# EAGLE design AltiSphere 2 (EAGLE 5.11)
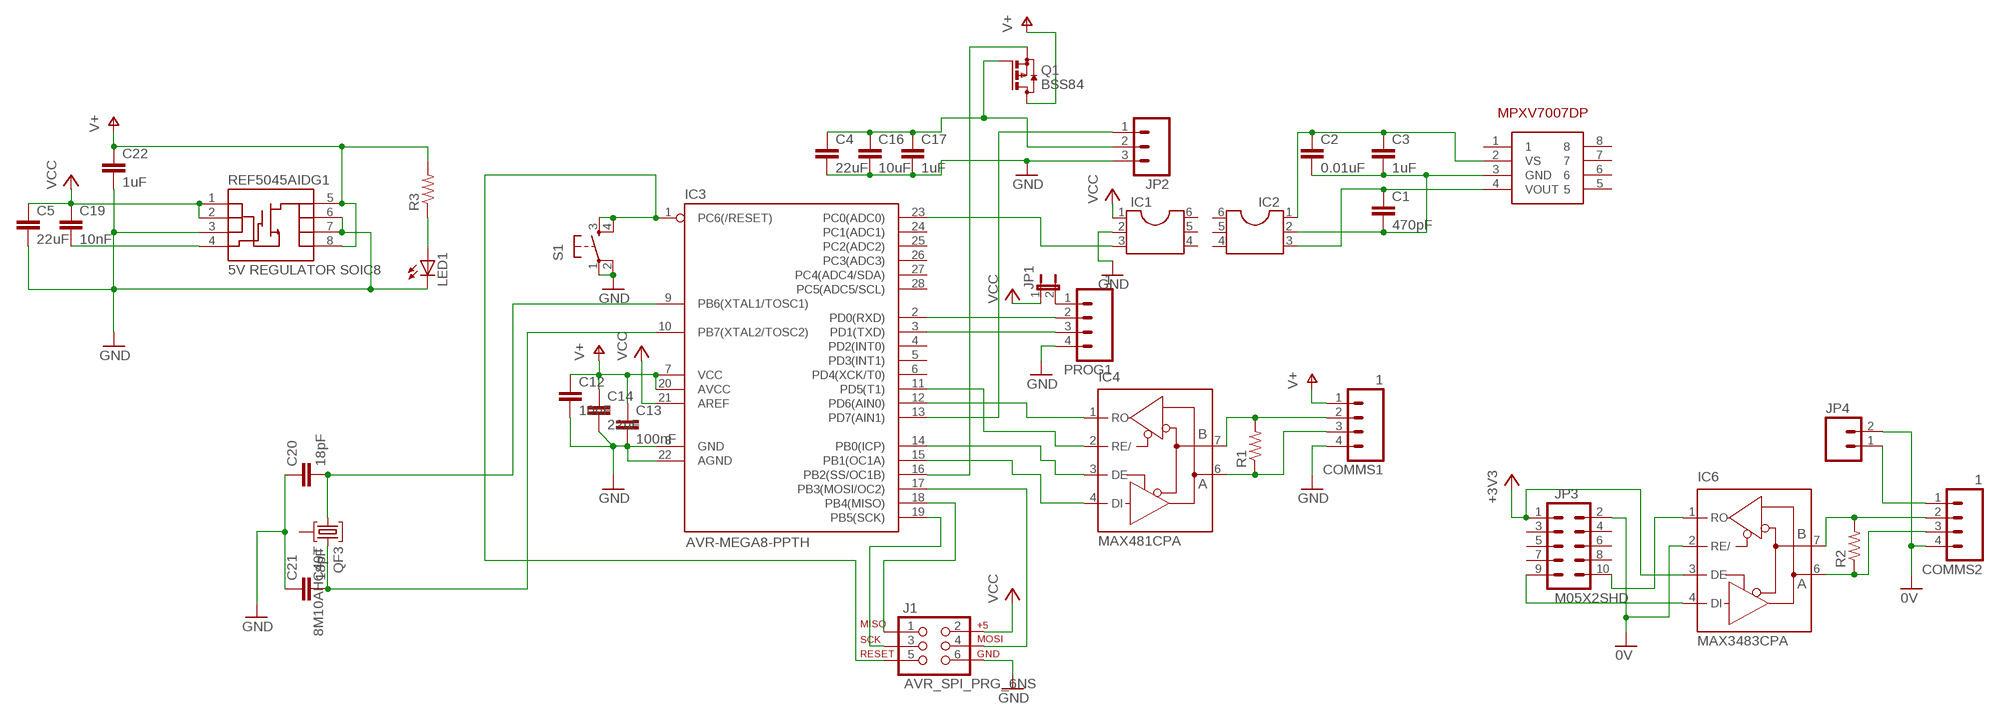
[diagram p0: schematic, sheet 1]

## Parts
C1  470pF  CAP0805  [0805]
C2  0.01uF  CAP0805  [0805]
C3  1uF  CAP0805  [0805]
C4  22uF  CAP1210  [1210]
C5  22uF  CAP1210  [1210]
C12  10nF  CAP0805  [0805]
C13  100nF  CAP0805  [0805]
C14  22uF  CAP0805  [0805]
C16  10uF  CAP0805  [0805]
C17  1uF  CAP0805  [0805]
C19  10nF  CAP0805  [0805]
C20  18pF  CAP0805  [0805]
C21  18pF  CAP0805  [0805]
C22  1uF  CAP0805  [0805]
COMMS1  1  M04POLAR  [MOLEX-1X4]
COMMS2  1  M04POLAR  [MOLEX-1X4]
IC1  DIL6  [DIL06]
IC2  DIL6  [DIL06]
IC3  AVR-MEGA8-PPTH  [DIL28-3]
IC4  MAX481CPA  [DIL08]
IC6  MAX3483CPA  [DIL08]
J1  AVR_SPI_PRG_6NS  [2X3-NS]
JP1  JUMPER-2PTH  [1X02]
JP2  M03POLAR  [MOLEX-1X3]
JP3  M05X2SHD  [2X5-SHROUDED]
JP4  M02LOCK_LONGPADS  [1X02_LOCK_LONGPADS]
LED1  LEDCHIP-LED0805  [CHIP-LED0805]
PROG1  1  M04POLAR  [MOLEX-1X4]
Q1  BSS84  [SOT23]
QF3  8M10AHC49T  [HC49U]
R1  RESISTOR0805-RES  [0805]
R2  RESISTOR0805-RES  [0805]
R3  RESISTOR0805-RES  [0805]
REF5045AIDG1  5V REGULATOR SOIC8  MOSFET-NCHANNEL-SOIC8  [SO08]
S1  TAC_SWITCHPTH  [TACTILE-PTH]
U$1  MPXV7007DPSOIC  [MPXV7007DP]

## Nets
0V: COMMS2.4 IC6.2(RE/) JP3.2 JP4.2
+3V3: IC6.3(DE) JP3.1
GND: C4.2 C5.2 C12.2 C13.2 C14.2 C16.2 C17.2 C20.1 C21.1 C22.2 COMMS1.4 IC1.2 IC3.8(GND) IC3.22(AGND) J1.6 JP2.3 LED1.C PROG1.4 REF5045AIDG1.3(S) REF5045AIDG1.6(D) REF5045AIDG1.7(D) S1.1 S1.2
N$1: C4.1 C16.1 C17.1 JP2.2 Q1.1(G)
N$2: IC3.19(PB5(SCK)) J1.3
N$3: IC3.1(PC6(/RESET)) J1.5 S1.3 S1.4
N$4: IC1.3 IC3.23(PC0(ADC0))
N$5: IC3.18(PB4(MISO)) J1.1
N$6: IC3.17(PB3(MOSI/OC2)) J1.4
N$7: IC3.13(PD7(AIN1)) JP2.1
N$8: COMMS1.2 IC4.7(B) R1.2
N$9: COMMS1.3 IC4.6(A) R1.1
N$10: IC3.2(PD0(RXD)) PROG1.2
N$11: IC3.3(PD1(TXD)) PROG1.3
N$12: IC3.12(PD6(AIN0)) IC4.1(RO)
N$13: IC3.11(PD5(T1)) IC4.2(RE/)
N$14: IC3.14(PB0(ICP)) IC4.3(DE)
N$15: IC3.15(PB1(OC1A)) IC4.4(DI)
N$16: JP1.2 PROG1.1
N$17: C20.2 IC3.9(PB6(XTAL1/TOSC1)) QF3.1
N$18: C21.2 IC3.10(PB7(XTAL2/TOSC2)) QF3.3
N$19: IC3.16(PB2(SS/OC1B)) Q1.2(S)
N$20: COMMS2.2 IC6.7(B) R2.2
N$21: COMMS2.3 IC6.6(A) R2.1
N$22: LED1.A R3.1
N$23: C19.2 REF5045AIDG1.4(G)
N$24: IC6.1(RO) JP3.10
N$25: IC6.4(DI) JP3.9
N$27: COMMS2.1 JP4.1
N$31: C1.1 IC2.3 U$1.4(VOUT)
N$32: C2.1 C3.1 IC2.1 U$1.2(VS)
N$34: C1.2 C2.2 C3.2 IC2.2 U$1.3(GND)
V+: C12.1 C13.1 C14.1 C22.1 COMMS1.1 IC3.7(VCC) IC3.20(AVCC) Q1.3(D) R3.2 REF5045AIDG1.5(D) REF5045AIDG1.8(D)
VCC: C5.1 C19.1 IC1.1 IC3.21(AREF) J1.2 JP1.1 REF5045AIDG1.1(S) REF5045AIDG1.2(S)
Unconnected: IC1.4 IC1.5 IC1.6 IC2.4 IC2.5 IC2.6 IC3.4(PD2(INT0)) IC3.5(PD3(INT1)) IC3.6(PD4(XCK/T0)) IC3.24(PC1(ADC1)) IC3.25(PC2(ADC2)) IC3.26(PC3(ADC3)) IC3.27(PC4(ADC4/SDA)) IC3.28(PC5(ADC5/SCL)) JP3.3 JP3.4 JP3.5 JP3.6 JP3.7 JP3.8 QF3.2 U$1.1 U$1.5 U$1.6 U$1.7 U$1.8

## Power pins joined to a net without a drawn wire
0V: IC6.5(0V)
+3V3: IC6.8(+3V3)
GND: IC4.5(GND)
VCC: IC4.8(VCC)

## Library data of the parts
C1-C5 C12-C14 C16 C17 C19-C22 = SparkFun:CAP: Capacitor Standard 0603 ceramic capacitor, and 0.1" leaded capacitor.
COMMS1 COMMS2 PROG1 = SparkFun:M04: Header 4 Standard 4-pin 0.1" header. Use with straight break away headers (SKU : PRT-00116), right angle break away headers (PRT-00553), swiss pins (PRT-00743), machine pins (PRT-00117), and female headers (PRT-00115). Molex polarized connector foot print use with SKU : PRT-08231 with associated crimp pins and housings. 1MM SMD Version SKU: PRT-10208
IC1 IC2 = ic-package:DIL6: Dual In Line / Socket
IC3 = SparkFun:AVR-MEGA8-P: MICROCONTROLLER 8 Kbytes FLASH 1 kbytes SRAM 512 bytes EEPROM USART 4-channel 10 bit ADC 2-channel 8 bit ADC
IC4 = maxim:MAX481CPA: RS485 TRANSEIVER; MPN: MAX481CPA+; OC_FARNELL: unknown; OC_NEWARK: 99K3445
IC6 = maxim-10:MAX3483CPA: RS485 TRANSEIVER
J1 = SparkFun:AVR_SPI_PRG_6: AVR ISP 6 Pin This is the reduced ISP connector for AVR programming. Common on Arduino. This footprint will take up less PCB space and can be used with a 10-pin to 6-pin adapter such as SKU: BOB-08508
JP1 = SparkFun:JUMPER-2: Jumper Basic 0.1" spaced jumper. Use with breakaway headers.
JP2 = SparkFun:M03: Header 3 Standard 3-pin 0.1" header. Use with straight break away headers (SKU : PRT-00116), right angle break away headers (PRT-00553), swiss pins (PRT-00743), machine pins (PRT-00117), and female headers (PRT-00115). Molex polarized connector foot print use with SKU : PRT-08232 with associated crimp pins and housings.
JP3 = SparkFun:M05X2: Header 5x2 Standard 10-pin dual row 0.1" header. Commonly used with AVR-ISP. Use with Spark Fun Electronics SKU: PRT-00778
JP4 = SparkFun:M02: Header 2 Standard 2-pin 0.1" header. Use with straight break away headers (SKU : PRT-00116), right angle break away headers (PRT-00553), swiss pins (PRT-00743), machine pins (PRT-00117), and female headers (PRT-00115). Molex polarized connector foot print use with SKU : PRT-08233 with associated crimp pins and housings.
LED1 = led:LED: LED OSRAM: - CHIPLED LG R971, LG N971, LY N971, LG Q971, LY Q971, LO R971, LY R971 LH N974, LH R974 LS Q976, LO Q976, LY Q976 LO Q996 - Hyper CHIPLED LW Q18S LB Q993, LB Q99A, LB R99A - SideLED LS A670, LO A670, LY A670, LG A670, LP A670 LB A673, LV A673, LT A673, LW A673 LH A674 LY A675 LS A676, LA A676, LO A676, LY A676, LW A676 LS A679, LY A679, LG A679 - Hyper Micro SIDELED® LS Y876, LA Y876, LO Y876, LY Y876 LT Y87S - SmartLED LW L88C, LW L88S LB L89C, LB L89S, LG L890 LS L89K, LO L89K, LY L89K LS L896, LA L896, LO L896, LY L896 - TOPLED LS T670, LO T670, LY T670, LG T670, LP T670 LSG T670, LSP T670, LSY T670, LOP T670, LYG T670 LG T671, LOG T671, LSG T671 LB T673, LV T673, LT T673, LW T673 LH T674 LS T676, LA T676, LO T676, LY T676, LB T676, LH T676, LSB T676, LW T676 LB T67C, LV T67C, LT T67C, LS T67K, LO T67K, LY T67K, LW E67C LS E67B, LA E67B, LO E67B, LY E67B, LB E67C, LV E67C, LT E67C LW T67C LS T679, LY T679, LG T679 LS T770, LO T770, LY T770, LG T770, LP T770 LB T773, LV T773, LT T773, LW T773 LH T774 LS E675, LA E675, LY E675, LS T675 LS T776, LA T776, LO T776, LY T776, LB T776 LHGB T686 LT T68C, LB T68C - Hyper Mini TOPLED® LB M676 - Mini TOPLED Santana® LG M470 LS M47K, LO M47K, LY M47K Source: http://www.osram.convergy.de LUXEON: - LUMILED® LXK2-PW12-R00, LXK2-PW12-S00, LXK2-PW14-U00, LXK2-PW14-V00 LXK2-PM12-R00, LXK2-PM12-S00, LXK2-PM14-U00 LXK2-PE12-Q00, LXK2-PE12-R00, LXK2-PE12-S00, LXK2-PE14-T00, LXK2-PE14-U00 LXK2-PB12-K00, LXK2-PB12-L00, LXK2-PB12-M00, LXK2-PB14-N00, LXK2-PB14-P00, LXK2-PB14-Q00 LXK2-PR12-L00, LXK2-PR12-M00, LXK2-PR14-Q00, LXK2-PR14-R00 LXK2-PD12-Q00, LXK2-PD12-R00, LXK2-PD12-S00 LXK2-PH12-R00, LXK2-PH12-S00 LXK2-PL12-P00, LXK2-PL12-Q00, LXK2-PL12-R00 Source: www.luxeon.com KINGBRIGHT: KA-3528ASYC Source: www.kingbright.com
Q1 = transistor-small-signal:BSS84: P-CHANNEL MOS FET
QF3 = crystal:8M10AHC49T: Monolithic Crystal Filters Source: www.vanlong.com; OC_FARNELL: unknown; OC_NEWARK: unknown
R1-R3 = SparkFun:RESISTOR: Resistor Basic schematic elements and footprints for 0603, 1206, and PTH resistors.
REF5045AIDG1 = SparkFun:MOSFET-NCHANNEL-SOIC8: N-Channel MOSFET IRF9410 and NDS8434 are common, SOIC-8 parts.
S1 = SparkFun:TAC_SWITCH: Momentary Switch Button commonly used for reset or general input. Spark Fun Electronics SKU : COM-00097
U$1 = Mine:MPXV7007DP

## Board
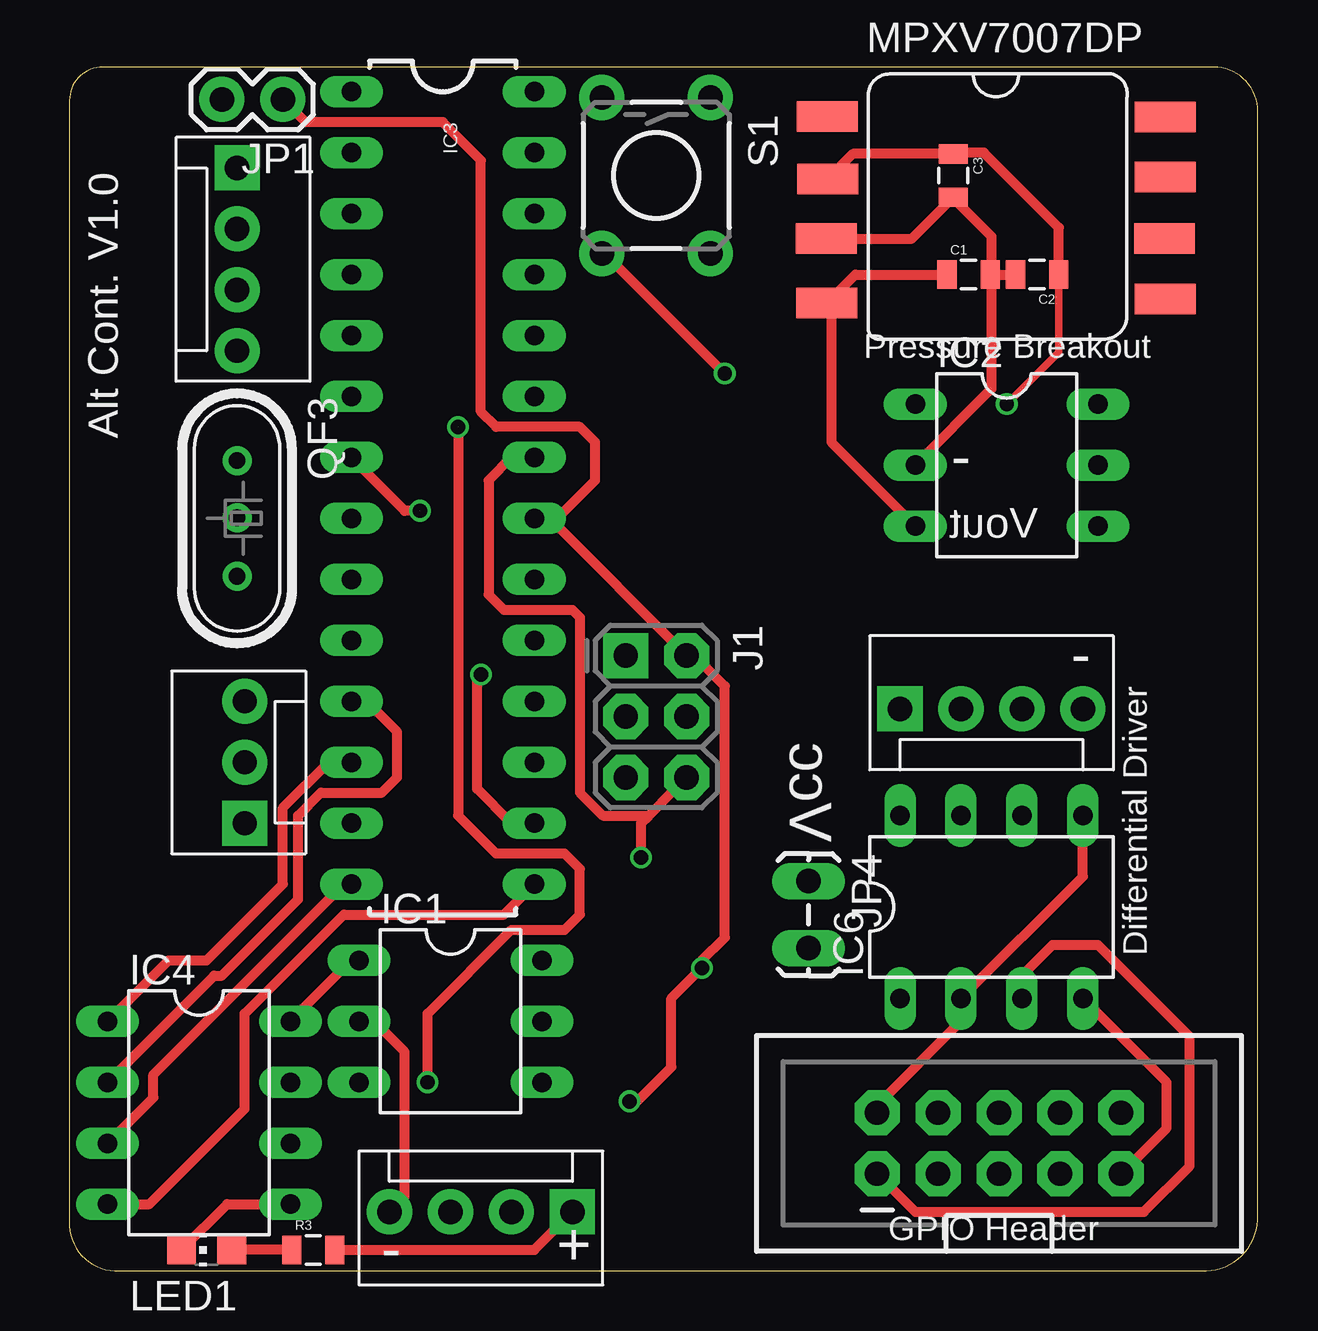
[diagram p1: board, top side]
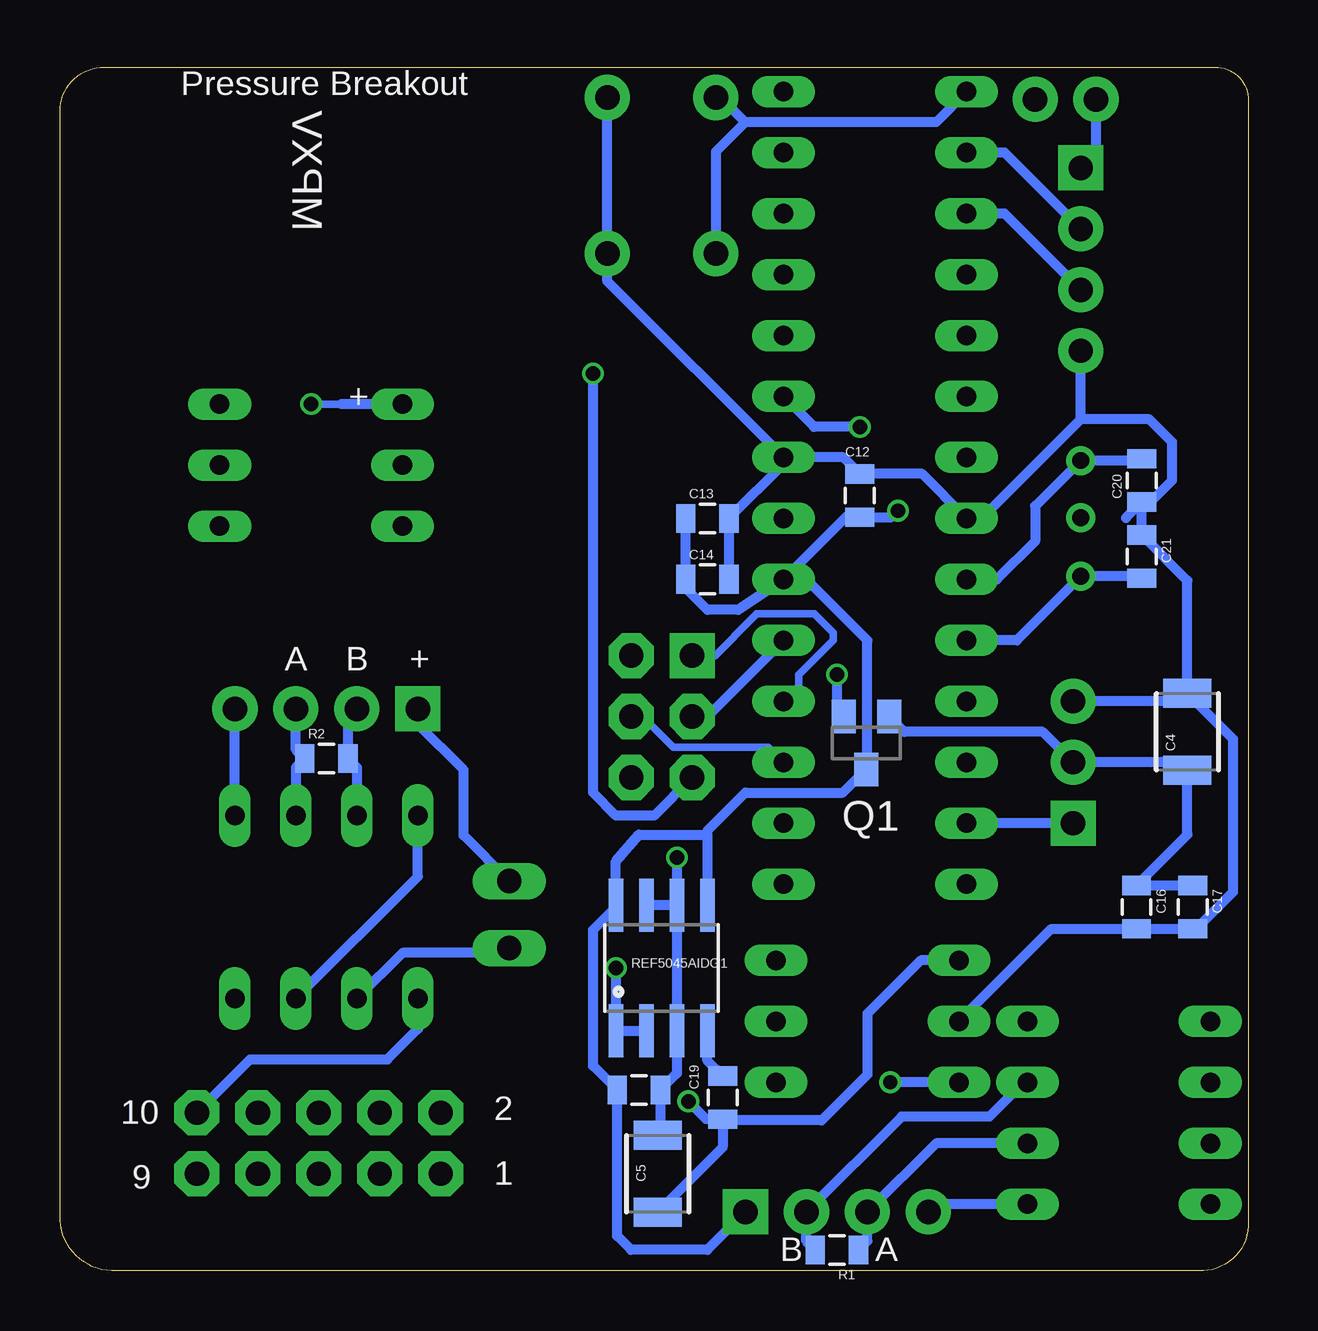
[diagram p2: board, bottom side, seen from below]

Size 49.52 x 50.16 mm. Coordinates in mm from the lower left corner, seen from the top.
Outline: 1.38,50.16 arc90 0,48.78 0,2.05 arc90 1.89,0 47.36,0 arc90 49.52,2.31 49.52,48.32 arc90 47.68,50.16 1.38,50.16
Copper layers (1*16): Top 0.035mm / dielectric 1.5mm / Bottom 0.035mm
Design rules "Fusion_eagle_rule_v1.1": minimum track width 6mil, minimum drill 12mil, track to track 6mil, track to pad 6mil, pad to pad 6mil, via to via 6mil, smd to smd 0mil, copper to edge 10mil, drill to drill 10mil, minimum pad ring 10mil, minimum via ring 6mil, stop-mask expansion 2mil, vias tented up to drill 100mil, thermal gap 10mil

### Footprints (pad centres in the part's own frame; a part is rotated, then mirrored left to right if it is on the bottom)
0805 = smd 0.8 x 1.2: 1 -0.9,0; 2 0.9,0
1210 = smd 1.2 x 2: 1 -1.6,0; 2 1.6,0
MOLEX-1X4 = drill 1.016 pad 1.88 square: 1 0,0 | drill 1.016 pad 1.88 round: 2 2.54,0; 3 5.08,0; 4 7.62,0
DIL06 = drill 0.813 long: 1 -2.54,-3.81; 2 0,-3.81; 3 2.54,-3.81; 4 2.54,3.81; 5 0,3.81; 6 -2.54,3.81
DIL28-3 = drill 0.813 long: 1 -16.51,-3.81; 2 -13.97,-3.81; 3 -11.43,-3.81; 4 -8.89,-3.81; 5 -6.35,-3.81; 6 -3.81,-3.81; 7 -1.27,-3.81; 8 1.27,-3.81; 9 3.81,-3.81; 10 6.35,-3.81; 11 8.89,-3.81; 12 11.43,-3.81; 13 13.97,-3.81; 14 16.51,-3.81; 15 16.51,3.81; 16 13.97,3.81; 17 11.43,3.81; 18 8.89,3.81; 19 6.35,3.81; 20 3.81,3.81; 21 1.27,3.81; 22 -1.27,3.81; 23 -3.81,3.81; 24 -6.35,3.81; 25 -8.89,3.81; 26 -11.43,3.81; 27 -13.97,3.81; 28 -16.51,3.81
DIL08 = drill 0.813 long: 1 -3.81,-3.81; 2 -1.27,-3.81; 3 1.27,-3.81; 4 3.81,-3.81; 5 3.81,3.81; 6 1.27,3.81; 7 -1.27,3.81; 8 -3.81,3.81
2X3-NS = drill 1.016 pad 1.88 square: 1 -2.54,-1.27 | drill 1.016 pad 1.88 octagon: 2 -2.54,1.27; 3 0,-1.27; 4 0,1.27; 5 2.54,-1.27; 6 2.54,1.27
1X02 = drill 1.016 pad 1.88 round: 1 0,0; 2 2.54,0
MOLEX-1X3 = drill 1.016 pad 1.88 square: 1 0,0 | drill 1.016 pad 1.88 round: 2 2.54,0; 3 5.08,0
2X5-SHROUDED = drill 1.016 pad 1.88 octagon: 1 -1.27,5.08; 2 1.27,5.08; 3 -1.27,2.54; 4 1.27,2.54; 5 -1.27,0; 6 1.27,0; 7 -1.27,-2.54; 8 1.27,-2.54; 9 -1.27,-5.08; 10 1.27,-5.08
1X02_LOCK_LONGPADS = drill 1.016 long: 1 -0.127,0; 2 2.667,0
CHIP-LED0805 = smd 1.2 x 1.2: A 0,-1.05; C 0,1.05
SOT23 = smd 1 x 1.4: 1 -0.95,-1.1; 2 0.95,-1.1; 3 0,1.1
HC49U = drill 0.7 pad 1.2 round: 1 -2.413,0; 2 -0.027,0; 3 2.413,0
SO08 = smd 0.61 x 2.21: 1 -1.905,-2.616; 2 -0.635,-2.616; 3 0.635,-2.616; 4 1.905,-2.616; 5 1.905,2.616; 6 0.635,2.616; 7 -0.635,2.616; 8 -1.905,2.616
TACTILE-PTH = drill 1.016 pad 1.88 round: 1 -3.251,2.261; 2 3.251,2.261; 3 -3.251,-2.261; 4 3.251,-2.261
MPXV7007DP = smd 1.27 x 2.54: 1 -3.81,-7.087; 2 -1.206,-7.074; 3 1.27,-7.137; 4 3.962,-7.112; 5 3.785,6.985; 6 1.27,6.96; 7 -1.295,6.985; 8 -3.785,6.985

### Placement (x,y rotation side)
C1  37.47,41.51 0 top
C2  40.32,41.51 180 top
C3  36.83,45.64 270 top
C4  2.54,22.46 90 bottom
C5  24.61,4.05 90 bottom
C12  16.19,32.3 90 bottom
C13  22.54,31.35 0 bottom
C14  22.54,28.81 0 bottom
C16  4.66,15.15 270 bottom
C17  2.32,15.16 270 bottom
C19  21.91,7.22 90 bottom
C20  4.45,32.94 90 bottom
C21  4.45,29.76 270 bottom
C22  25.4,7.54 0 bottom
COMMS1  20.95,2.46 180 top
COMMS2  34.61,23.41 0 top
IC1  15.87,10.4 270 top
IC2  39.05,33.57 270 top
IC3  15.56,32.62 270 top
IC4  5.4,6.59 270 top
IC6  38.42,15.16 0 top
J1  24.45,23.1 270 top
JP1  8.89,48.81 180 top
JP2  7.3,18.65 90 top
JP3  38.73,5.32 90 top
JP4  30.8,16.11 270 top
LED1  5.71,0.87 90 top
PROG1  6.98,45.96 270 top
Q1  15.92,22 180 bottom
QF3  6.98,31.35 270 top
R1  17.15,0.87 180 bottom
R2  38.42,21.35 0 bottom
R3  10.16,0.87 0 top
REF5045AIDG1  24.45,12.62 0 bottom
S1  24.45,45.64 270 top
U$1  38.67,44.28 270 top

### Tracks (layer width: path | path; a pad name or v marks a point on that pad's centre or on a via)
0V
  Top 0.406: IC6.5 42.23,16.43 IC6.2 37.15,10.4 33.66,6.9 JP3.2
  Bottom 0.406: IC6.5 COMMS2.4 | JP4.2 30.99,13.25 35.24,13.25 IC6.2
+3V3
  Top 0.406: JP3.1 35.24,2.46 44.77,2.46 46.67,4.36 46.67,9.76 42.86,13.57 40.96,13.57 39.69,12.3 IC6.3
  Bottom 0.406: IC6.8 34.61,16.43 IC6.3
GND  (via drill 0.6)
  Top 0.406: COMMS1.4 13.97,3.09 13.97,9.13 12.7,10.4 IC1.2 | LED1.C 6.57,2.78 IC4.5 | 24.13,18.97 25.16,20 J1.6 | 24.13,18.97 22.23,18.97 21.27,19.92 21.27,27.22 20.95,27.54 18.1,27.54 17.46,28.18 17.46,32.94 18.41,33.89 IC3.22 | v23.81,17.22 23.81,18.65 24.13,18.97
  Bottom 0.406: C5.2 24.5,5.75 C22.2 23.81,8.23 REF5045AIDG1.3 REF5045AIDG1.6 | REF5045AIDG1.6 REF5045AIDG1.7 | COMMS1.4 13.02,2.78 IC4.5 | IC1.2 8.21,14.25 C16.2 C17.2 2.17,14.26 0.63,15.79 0.63,22.16 C4.2 | C4.2 2.87,23.73 JP2.3 | C20.1 C21.1 2.54,28.76 C4.2 | C20.1 5.11,31.38 | 6.98,35.48 11.11,31.35 IC3.8 13.6,33.2 C12.2 16.88,33.89 IC3.22 | 6.98,35.48 PROG1.4 | C20.1 4.39,31.99 4.13,31.99 3.18,32.94 3.18,34.53 4.13,35.48 6.98,35.48 | S1.1 S1.2 26.71,41.23 IC3.22 | C14.2 C13.2 19.37,33.63 IC3.22 | v23.81,17.22 REF5045AIDG1.6
N$1
  Bottom 0.406: Q1.1 14.33,22.46 8.57,22.46 JP2.2 2.87,21.19 C4.1 2.54,18.18 C16.1 C17.1
N$2
  Bottom 0.406: J1.3 22.54,23.1 IC3.19
N$3  (via drill 0.6)
  Top 0.406: v27.3,37.38 22.3,42.39 S1.4
  Bottom 0.406: IC3.1 13.02,47.86 20.95,47.86 | 20.95,47.86 21.98,48.89 S1.3 | 20.95,47.86 22.19,46.63 S1.4 | J1.5 24.77,18.97 26.35,18.97 27.3,19.92 v27.3,37.38
N$4  (via drill 0.6)  (1 unrouted)
  Top 0.406: v14.92,7.86 14.92,10.71 18.41,14.21 20.64,14.21 21.27,14.84 21.27,16.75 20.64,17.38 17.78,17.38 16.19,18.97 v16.19,35.16
  Bottom 0.406: IC3.23 18.1,35.16 v16.19,35.16 | IC1.3 v14.92,7.86
N$5
  Bottom 0.305: J1.1 22.23,25.64 20.64,27.22 20.48,27.38 18.1,27.38 17.3,26.59 17.3,26.27 18.73,24.84 18.73,24.37 IC3.18
N$6
  Bottom 0.305: J1.4 25.24,23.1 23.97,21.83 20,21.83 IC3.17
N$7
  Bottom 0.406: JP2.1 IC3.13
N$8
  Bottom 0.406: R1.2 18.41,1.24 COMMS1.2 14.45,6.43 10.79,6.43 9.37,7.86 IC4.7
N$9
  Bottom 0.406: IC4.6 13.02,5.32 COMMS1.3 15.87,1.24 R1.1
N$10
  Bottom 0.406: PROG1.2 10.16,46.59 IC3.2
N$11
  Bottom 0.406: PROG1.3 10.16,44.05 IC3.3
N$12
  Top 0.406: IC4.1 4.13,12.94 5.71,12.94 8.89,16.11 8.89,19.29 10.79,21.19 IC3.12
N$13
  Top 0.406: IC4.2 6.03,12.3 6.35,12.3 9.53,15.48 9.53,18.97 10.48,19.92 13.02,19.92 13.65,20.56 13.65,22.46 12.38,23.73 IC3.11
N$14
  Top 0.406: IC4.3 3.49,7.22 3.49,8.17 11.43,16.11 IC3.14
N$15
  Top 0.406: IC3.15 18.1,14.84 11.43,14.84 7.3,10.71 7.3,6.74 3.33,2.78 IC4.4
N$16
  Bottom 0.406: PROG1.1 6.35,46.59 JP1.2
N$17
  Bottom 0.406: C20.2 4.52,33.76 QF3.1 8.89,31.86 8.89,30.4 10.48,28.81 IC3.9
N$18
  Bottom 0.406: C21.2 4.52,28.94 QF3.3 9.65,26.27 IC3.10
N$19  (via drill 0.6)
  Top 0.406: IC3.16 18.41,18.65 16.99,20.08 16.99,24.68 v17.15,24.84
  Bottom 0.406: v17.15,24.84 17.15,23.37 Q1.2
N$20
  Bottom 0.406: COMMS2.2 37.52,23.04 R2.2 37.15,20.98 IC6.7
N$21
  Bottom 0.406: COMMS2.3 39.69,21.72 R2.1 39.69,20.98 IC6.6
N$22
  Top 0.406: R3.1 LED1.A
N$23
  Bottom 0.406: C19.2 22.54,8.76 REF5045AIDG1.4
N$24
  Bottom 0.406: JP3.10 41.59,8.81 35.88,8.81 34.61,10.08 IC6.1
N$25
  Top 0.406: JP3.9 45.72,5.95 45.72,7.86 IC6.4
N$27
  Bottom 0.406: JP4.1 32.7,18.14 32.7,20.87 34.61,22.78 COMMS2.1
N$31
  Top 0.406: C1.1 32.75,41.51 U$1.4 31.75,40.13 31.75,34.53 IC2.3
N$32  (via drill 0.6)
  Top 0.305: C2.1 41.22,38.28 v39.05,36.11
  Top 0.406: U$1.2 32.64,46.54 C3.1 36.88,46.59 38.1,46.59 41.22,43.47 C2.1
  Bottom 0.305: 36.99,36.11 v39.05,36.11
  Bottom 0.406: IC2.1 36.99,36.11 37.78,36.11
N$33  (1 unrouted)
N$34
  Top 0.406: C1.2 C2.2 | C1.2 38.42,41.56 38.42,43.1 36.83,44.69 C3.2 35.1,43.01 U$1.3 | C1.2 38.42,41.46 38.42,36.75 IC2.2
N$35  (1 unrouted)
V+  (via drill 0.6)
  Top 0.406: COMMS1.1 19.37,0.87 R3.2 | v14.6,31.67 13.97,31.67 IC3.7
  Bottom 0.406: COMMS1.1 22.54,0.87 25.72,0.87 26.3,1.45 C22.1 27.3,8.54 27.3,14.21 26.35,15.16 REF5045AIDG1.8 26.35,17.06 25.4,18.17 22.54,18.17 | 22.54,18.17 REF5045AIDG1.5 | 22.54,18.17 22.54,18.33 20.95,19.92 16.9,19.92 Q1.3 15.87,20.94 15.87,26.27 18.41,28.81 IC3.20 | IC3.20 16.77,31.4 C12.1 14.87,31.4 v14.6,31.67 | IC3.20 21.27,27.54 22.54,27.54 23.44,28.44 C14.1 C13.1
VCC  (via drill 0.6)
  Top 0.406: JP1.1 9.84,47.86 15.56,47.86 17.15,46.27 17.15,35.8 17.78,35.16 21.27,35.16 21.91,34.53 21.91,32.94 20.32,31.35 IC3.21 20,31.35 J1.2 26.03,25.64 27.3,24.37 27.3,13.89 26.35,12.94 v26.35,12.62 25.08,11.35 25.08,8.49 23.65,7.06 v23.34,7.06 | IC4.8 11.75,12.94 IC1.1
  Bottom 0.406: C5.1 21.91,5.14 C19.1 | C19.1 21.85,6.27 17.78,6.27 15.87,8.17 15.87,10.71 13.65,12.94 IC1.1 | REF5045AIDG1.2 REF5045AIDG1.1 v26.35,12.62 | C19.1 22.59,6.32 v23.34,7.06

### Text on the board
_tsilk: Pressure Breakout | Alt Cont. V1.0 | - | Vout | - | Vcc | Differential Driver | GPIO Header | - | +
_bsilk: Pressure Breakout | MPXV | + | + | B | A | 2 | 10 | 1 | 9 | A | B